# EAGLE design power (EAGLE 7.2.0)
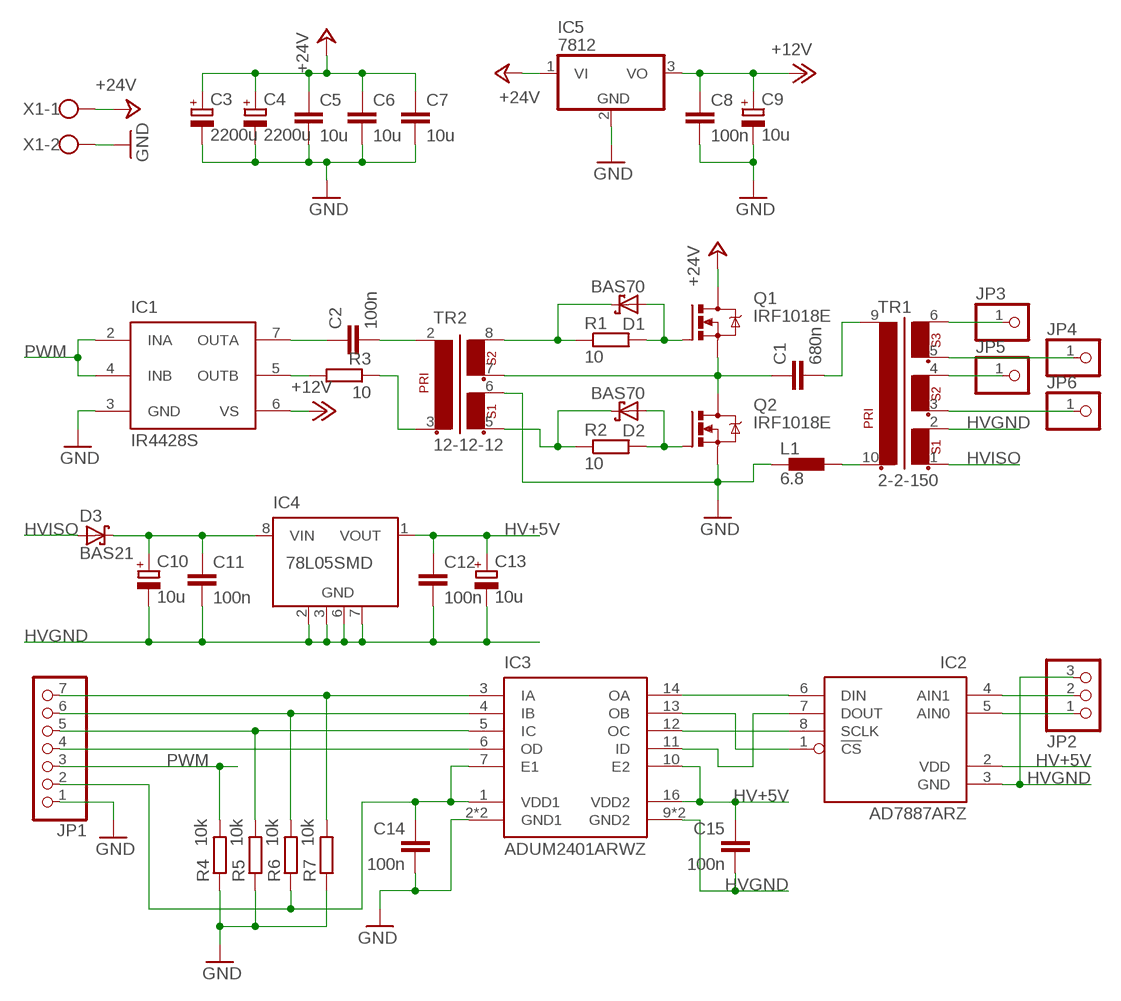
[diagram p0: schematic, sheet 1]

## Parts
C1  680n  C-EU150-084X183  [C150-084X183]
C2  100n  C-EUC1206  [C1206]
C3  2200u  CPOL-EUE7.5-16  [E7,5-16]
C4  2200u  CPOL-EUE7.5-16  [E7,5-16]
C5  10u  C-EUC1210  [C1210]
C6  10u  C-EUC1210  [C1210]
C7  10u  C-EUC1210  [C1210]
C8  100n  C-EUC1206  [C1206]
C9  10u  CPOL-EUB/3528-21R  [B/3528-21R]
C10  10u  CPOL-EUB/3528-21R  [B/3528-21R]
C11  100n  C-EUC1206  [C1206]
C12  100n  C-EUC1206  [C1206]
C13  10u  CPOL-EUB/3528-21R  [B/3528-21R]
C14  100n  C-EUC1206  [C1206]
C15  100n  C-EUC1206  [C1206]
D1  BAS70  [SOT23]
D2  BAS70  [SOT23]
D3  BAS21  BAS70  [SOT23]
IC1  IR4428S  [SO08]
IC2  AD7887ARZ  [SO08]
IC3  ADUM2401ARWZ  [SO-16W]
IC4  78L05SMD  [SO08]
IC5  7812  [D2PACK]
JP1  PINHD-1X7/90  [1X07/90]
JP2  PINHD-1X3/90  [1X03/90]
JP3  PINHD-1X1  [1X01]
JP4  PINHD-1X1  [1X01]
JP5  PINHD-1X1  [1X01]
JP6  PINHD-1X1  [1X01]
L1  6.8  TSL1112  [TSL1112]
Q1  IRF1018E  [TO220BV]
Q2  IRF1018E  [TO220BV]
R1  10  R-EU_R0805  [R0805]
R2  10  R-EU_R0805  [R0805]
R3  10  R-EU_R0805  [R0805]
R4  10k  R-EU_R0805  [R0805]
R5  10k  R-EU_R0805  [R0805]
R6  10k  R-EU_R0805  [R0805]
R7  10k  R-EU_R0805  [R0805]
TR1  2-2-150  [RM12T1]
TR2  12-12-12  [RM5LS]
X1  W237-102  [W237-102]

## Nets
!CS: IC3.3(IA) JP1.7 R7.2
+12V: C8.1 C9.+ IC1.6(VS) IC5.3(VO)
+24V: C3.+ C4.+ C5.1 C6.1 C7.1 IC5.1(VI) Q1.D X1.1
AIN1: IC2.4(AIN1) JP2.2
DIN: IC3.5(IC) JP1.5 R5.2
DOUT: IC3.6(OD) JP1.4
GND: C3.- C4.- C5.2 C6.2 C7.2 C8.2 C9.- C14.2 IC1.3(GND) IC3.2(GND1) IC3.8(GND1) IC5.2(GND) JP1.1 L1.P$1 Q2.S R4.1 R5.1 R7.1 TR2.6 X1.2
HV+5V: C12.1 C13.+ C15.1 IC2.2(VDD) IC3.10(E2) IC3.16(VDD2) IC4.1(VOUT)
HVGND: C10.- C11.2 C12.2 C13.- C15.2 IC2.3(GND) IC3.9(GND2) IC3.15(GND2) IC4.2(GND) IC4.3(GND) IC4.6(GND) IC4.7(GND) JP2.3 TR1.2
HVISO: D3.1(A) TR1.1
N$1: C1.1 Q1.S Q2.D TR2.7
N$2: D1.3(C) R1.1 TR2.8
N$3: D2.1(A) Q2.G R2.2
N$4: C1.2 TR1.9
N$5: D1.1(A) Q1.G R1.2
N$6: D2.3(C) R2.1 TR2.5
N$7: C10.+ C11.1 D3.3(C) IC4.8(VIN)
N$8: C2.1 IC1.7(OUTA)
N$9: R3.1 TR2.3
N$10: C2.2 TR2.2
N$11: C14.1 IC3.1(VDD1) IC3.7(E1) JP1.2 R6.1
N$12: IC2.1(!CS) IC3.13(OB)
N$13: IC2.8(SCLK) IC3.12(OC)
N$14: IC2.7(DOUT) IC3.11(ID)
N$15: IC2.5(AIN0) JP2.1
N$16: IC2.6(DIN) IC3.14(OA)
N$17: L1.P$2 TR1.10
N$18: JP3.1 TR1.6
N$19: JP4.1 TR1.5
N$20: JP5.1 TR1.4
N$21: JP6.1 TR1.3
N$29: IC1.5(OUTB) R3.2
PWM: IC1.2(INA) IC1.4(INB) JP1.3 R4.2
SCLK: IC3.4(IB) JP1.6 R6.2
Unconnected: IC4.4(NC) IC4.5(NC)

## Library data of the parts
C1 C2 C5-C8 C11 C12 C14 C15 = rcl:C-EU: CAPACITOR, European symbol
C3 C4 C9 C10 C13 = rcl:CPOL-EU: POLARIZED CAPACITOR, European symbol
D1-D3 = diode:BAS70: Silicon Schottky Diodes General-purpose diode for high-speed switching
IC1 = local:IR442*: DUAL LOW SIDE DRIVER Descriptions The IR4426/IR4427/IR4428 (S) is a low voltage, high speed power MOSFET and IGBT driver. Proprietary latch immune CMOS technologies enable ruggedized monolithic construction. Logic inputs are compatible with standard CMOS or LSTTL outputs. The output drivers feature a high pulse current buffer stage designed for minimum driver cross-conduction. Propagation delays between two channels are matched.
IC2 = 50w-modular-psu:AD7887: +2.7 V to +5.25 V, Micropower, 2-Channel, 125 kSPS, 12-Bit ADC in 8-Lead µSOIC GENERAL DESCRIPTION The AD7887 is a high speed, low power, 12-bit ADC that oper- ates from a single +2.7 V to +5.25 V power supply. The AD7887 is capable of 125 kSPS throughput rate. The input track-and- hold acquires a signal in 500 ns and features a single-ended sampling scheme. The output coding for the AD7887 is straight binary and the part is capable of converting full power signals up to 2.5 MHz.
IC3 = local:ADUM2401: Quad-Channel Digital Isolators The ADuM240x1 are 4-channel digital isolators based on Analog Devices, Inc., iCoupler® technology. Combining high speed CMOS and monolithic air core transformer technology, these isolation components provide outstanding performance characteristics that are superior to alternatives, such as optocoupler devices.
IC4 = local:78L*SMD: Positive VOLTAGE REGULATOR
IC5 = local:78*: Positive VOLTAGE REGULATOR Source: http://cache.national.com/ds/LM/LM78L05.pdf http://www.fairchildsemi.com/ds/LM/LM7805.pdf
JP1 = pinhead:PINHD-1X7: PIN HEADER
JP2 = pinhead:PINHD-1X3: PIN HEADER
JP3-JP6 = pinhead:PINHD-1X1: PIN HEADER
L1 = local:TSL1112
Q1 Q2 = local:IRF1018: HEXFET Power MOSFET VDSS 60V RDS(on) typ. 7.1m: max. 8.4m: ID 79A
R1-R7 = resistor:R-EU_: RESISTOR, European symbol
TR1 = local:2-2-150: Power Transformer Turns rate: 2/2/150/NC
TR2 = local:12-12-12: Gate Drive Transformer Turns rate: 12/12/12
X1 = con-wago-500:W237-102: WAGO SCREW CLAMP; MPN: 237-102; OC_FARNELL: unknown; OC_NEWARK: 70K9898

## Board
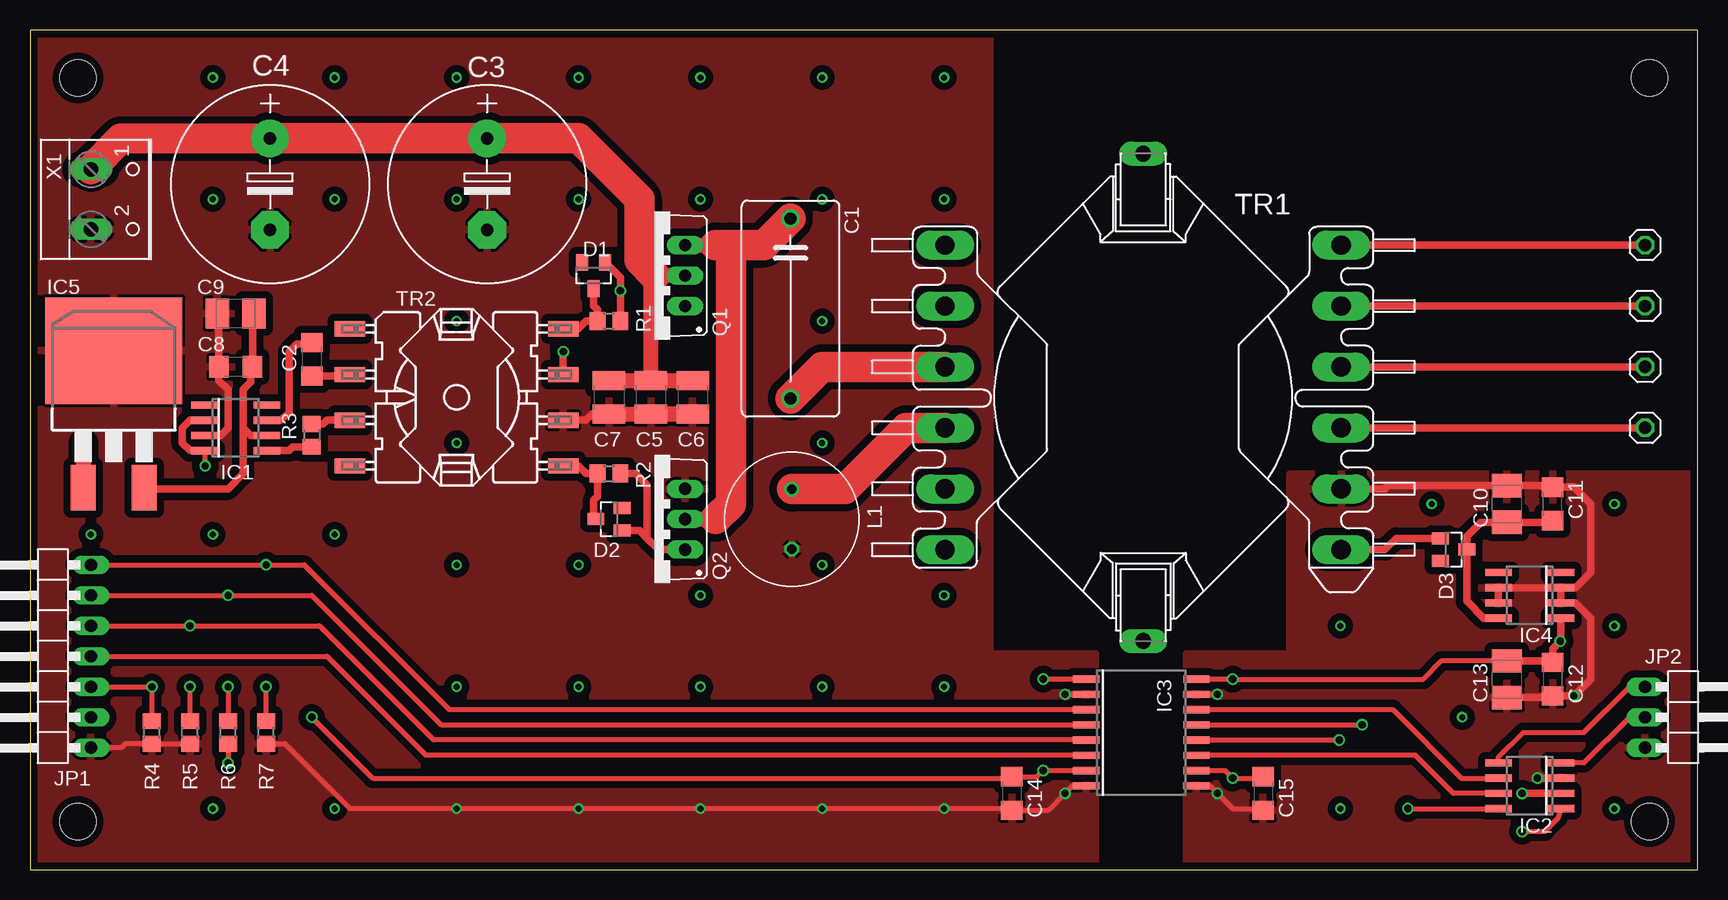
[diagram p1: board, top side]
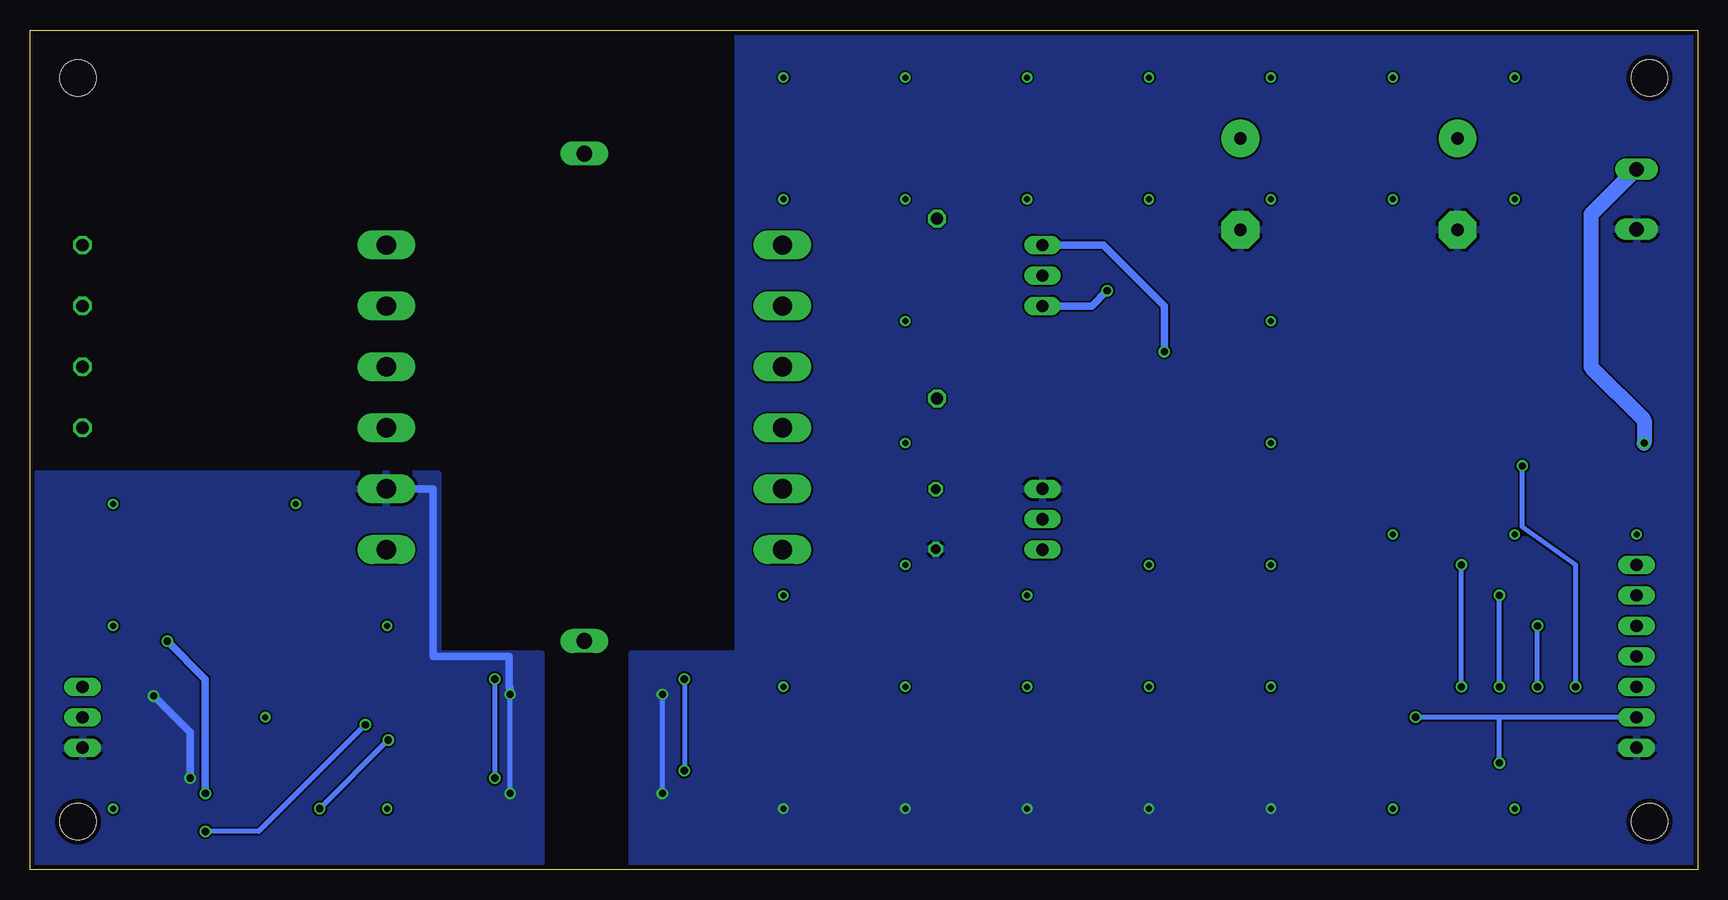
[diagram p2: board, bottom side, seen from below]

Size 139 x 70 mm. Coordinates in mm from the lower left corner, seen from the top.
Outline: 0,0 139,0 139,70 0,70 0,0
Copper layers (1*16): Top 0.0356mm / dielectric 1.5011mm / Bottom 0.0356mm
Design rules "LaenPCBOrder": minimum track width 6mil, minimum drill 13mil, track to track 6mil, track to pad 6mil, pad to pad 6mil, via to via 6mil, smd to smd 6mil, copper to edge 15mil, drill to drill 6mil, minimum pad ring 7mil, minimum via ring 7mil, stop-mask expansion 3mil, vias tented up to drill 0mil, thermal gap 10mil
Holes 3 mm at 4,4 4,66 135,66 135,4

### Footprints (pad centres in the part's own frame; a part is rotated, then mirrored left to right if it is on the bottom)
C150-084X183 = drill 1.016 octagon: 1 -7.493,0; 2 7.493,0
C1206 = smd 1.6 x 1.8: 1 -1.4,0; 2 1.4,0
E7,5-16 = drill 1.016 pad 3.15: + -3.81,0 | drill 1.016 pad 3.15 octagon: - 3.81,0
C1210 = smd 1.6 x 2.7: 1 -1.4,0; 2 1.4,0
B/3528-21R = smd 1.95 x 2.5: + 1.525,0; - -1.525,0
SOT23 = smd 1 x 1.4: 1 -0.95,-1.1; 2 0.95,-1.1; 3 0,1.1
SO08 = smd 0.6 x 2.2: 1 -1.905,-2.6; 2 -0.635,-2.6; 3 0.635,-2.6; 4 1.905,-2.6; 5 1.905,2.6; 6 0.635,2.6; 7 -0.635,2.6; 8 -1.905,2.6
SO-16W = smd 0.6 x 2.2: 1 -4.445,-4.6; 2 -3.175,-4.6; 3 -1.905,-4.6; 4 -0.635,-4.6; 5 0.635,-4.6; 6 1.905,-4.6; 7 3.175,-4.6; 8 4.445,-4.6; 9 4.445,4.6; 10 3.175,4.6; 11 1.905,4.6; 12 0.635,4.6; 13 -0.635,4.6; 14 -1.905,4.6; 15 -3.175,4.6; 16 -4.445,4.6
D2PACK = smd 2.083 x 3.81: 1 -2.54,-8.89; 3 2.54,-8.89 | smd 11.43 x 8.89: 2 0,2.54
1X07/90 = drill 1.016 long: 1 -7.62,-3.81; 2 -5.08,-3.81; 3 -2.54,-3.81; 4 0,-3.81; 5 2.54,-3.81; 6 5.08,-3.81; 7 7.62,-3.81
1X03/90 = drill 1.016 long: 1 -2.54,-3.81; 2 0,-3.81; 3 2.54,-3.81
1X01 = drill 1.016 octagon: 1 0,0
TSL1112 = drill 0.8 octagon: P$1 2.5,0; P$2 -2.5,0
TO220BV = drill 1.016 long: D 0,-2.54; G -2.54,-2.54; S 2.54,-2.54
R0805 = smd 1.3 x 1.5: 1 -0.95,0; 2 0.95,0
RM12T1 = drill 1.6 long: 1 16.51,-12.7; 2 16.51,-7.62; 3 16.51,-2.54; 4 16.51,2.54; 5 16.51,7.62; 6 16.51,12.7; 7 -16.51,12.7; 8 -16.51,7.62; 9 -16.51,2.54; 10 -16.51,-2.54; 11 -16.51,-7.62; 12 -16.51,-12.7 | drill 1.321 long: M 0,20.32; M@ 0,-20.32
RM5LS = smd 2.54 x 1.27: 1 -8.89,5.715; 2 -8.89,1.905; 3 -8.89,-1.905; 4 -8.89,-5.715; 5 8.89,-5.715; 6 8.89,-1.905; 7 8.89,1.905; 8 8.89,5.715
W237-102 = drill 1.194 long: 1 -2.5,-1.27; 2 2.5,-1.27

### Placement (x,y rotation side)
C1  63.39,46.77 270 top
C2  23.5,42.55 270 top
C3  38.1,57.15 270 top
C4  20,57.15 270 top
C5  51.75,39.37 270 top
C6  55.24,39.37 270 top
C7  48.26,39.37 270 top
C8  17.14,41.91 180 top
C9  17.14,46.35 0 top
C10  123.11,30.48 270 top
C11  126.92,30.48 90 top
C12  126.92,15.88 270 top
C13  123.11,15.88 90 top
C14  81.83,6.35 270 top
C15  102.79,6.35 270 top
D1  46.99,49.53 180 top
D2  48.26,29.21 90 top
D3  118.67,26.67 270 top
IC1  17.14,36.83 270 top
IC2  125.02,6.99 90 top
IC3  92.63,11.43 270 top
IC4  125.02,22.86 90 top
IC5  6.99,40.72 0 top
JP1  1.27,17.78 90 top
JP2  138.43,12.7 270 top
JP3  134.62,52.07 0 top
JP4  134.62,46.99 0 top
JP5  134.62,41.91 0 top
JP6  134.62,36.83 0 top
L1  63.5,29.21 270 top
Q1  52.07,49.53 90 top
Q2  52.07,29.21 90 top
R1  48.26,45.72 0 top
R2  48.26,33.02 0 top
R3  23.5,36.2 270 top
R4  10.16,11.43 90 top
R5  13.34,11.43 90 top
R6  16.51,11.43 90 top
R7  19.68,11.43 90 top
TR1  92.79,39.37 0 top
TR2  35.56,39.37 0 top
X1  6.35,55.88 270 top

### Tracks (layer width: path | path; a pad name or v marks a point on that pad's centre or on a via)
!CS  (via drill 0.6)
  Top 0.406: JP1.7 v19.68,25.4 22.86,25.4 34.92,13.34 IC3.3 | R7.2 v19.68,15.24
  Bottom 0.406: v19.68,15.24 v19.68,25.4
+12V
  Top 0.61: IC1.6 18.41,36.2 17.78,36.83 | 17.78,36.83 17.78,40.01 18.41,40.64 18.41,41.78 C8.1 18.55,45.59 C9.+ | 17.78,36.83 17.78,33.02 16.51,31.75 10.24,31.75 IC5.3
+24V  (via drill 0.6)
  Top 1.27: C7.1 C5.1 | C5.1 C6.1 | Q1.D 52.07,49.53 51.75,49.21 C5.1 | v4.45,35.56 IC5.1
  Top 2.54: 52.07,49.53 50.8,50.8 50.8,55.88 45.72,60.96 C3.+ C4.+ 7.58,60.92 X1.1
  Bottom 1.27: X1.1 5.12,58.38 8.89,54.61 8.89,41.91 4.45,37.47 v4.45,35.56
AIN1
  Top 0.406: JP2.2 133.35,12.7 129.54,8.89 IC2.4
DIN  (via drill 0.6)
  Top 0.406: JP1.5 v13.34,20.32 24.13,20.32 33.66,10.79 IC3.5 | R5.2 v13.34,15.24
  Bottom 0.406: v13.34,15.24 v13.34,20.32
DOUT
  Top 0.406: JP1.4 24.77,17.78 33.02,9.53 IC3.6
GND  (via drill 0.5, 0.6)
  Top 0.406: R5.1 R4.1 7.94,10.48 7.62,10.16 JP1.1 | R7.1 21.27,10.48 26.67,5.08 v35.56,5.08 v45.72,5.08 v55.88,5.08 v66.04,5.08 v76.2,5.08 81.07,5.08 C14.2 84.88,4.95 v86.28,6.35 86.92,6.99 IC3.8 | v86.28,14.61 IC3.2
  Top 0.61: C7.2 46.86,37.97 46.35,37.47 TR2.6 | IC1.3 15.88,36.2 16.51,36.83 16.51,40.01 15.74,40.77 C8.2 15.74,45.59 C9.-
  Top 1.27: C7.2 C5.2 C6.2 50.93,37.97 50.8,38.1
  Bottom 0.406: v86.28,6.35 v86.28,14.61
  pour Top (isolate 0.61): 0,0 0,70 80,70 80,18 88.8,18 88.8,0
  pour Bottom: 0,0 0,70 80,70 80,18 88.8,18 88.8,0
HV+5V  (via drill 0.6)
  Top 0.406: IC3.10 99.61,8.26 v100.25,7.62 102.66,7.62 C15.1 | IC3.16 v100.25,15.88 116.12,15.88 117.65,17.4 C13.+
  Top 0.61: C13.+ 126.8,17.4 C12.1 126.92,18.41 v127.56,19.05 127.61,19.11 IC4.1 | IC2.2 v124.38,6.35
  Bottom 0.406: v100.25,7.62 v100.25,15.88
  Bottom 0.61: v124.38,6.35 124.38,15.88 v127.56,19.05
HVGND  (via drill 0.6)
  Top 0.406: IC3.15 v98.98,14.61 | IC3.9 98.34,6.99 v98.98,6.35 100.25,5.08 102.66,5.08 C15.2
  Top 0.61: TR1.2 112.95,31.75 113.2,32.01 C10.- 126.8,32.01 C11.2 128.69,31.88 130.09,30.48 130.09,24.77 128.82,23.5 IC4.3 | IC4.7 IC4.6 IC4.3 | IC4.3 IC4.2 128.82,22.23 130.09,20.95 130.09,15.88 v128.69,14.47 C12.2 126.8,14.35 C13.- | IC2.3 v125.65,7.62
  Bottom 0.406: v98.98,6.35 v98.98,14.61
  Bottom 0.61: v125.65,7.62 125.65,11.43 v128.69,14.47 | v98.98,14.61 98.98,15.16 99.06,15.24 99.06,17.78 105.41,17.78 105.41,31.75 109.22,31.75
  pour Top (isolate 0.61): 96.4,18 96.4,0 139,0 139,33 105,33 105,18
  pour Bottom: 139,33 105,33 105,18 96.4,18 96.4,0 139,0
HVISO
  Top 0.61: D3.1 113.9,27.62 112.95,26.67 TR1.1
N$1  (via drill 0.6)
  Top 0.61: v44.45,43.18 TR2.7
  Top 1.27: Q1.S 57.15,52.07 | Q2.D 57.15,29.21
  Top 2.54: 57.15,52.07 58.42,52.07 | 58.42,52.07 61.2,52.07 C1.1 | 57.15,29.21 58.42,30.48 58.42,52.07
  Bottom 0.61: Q1.S 49.53,52.07 44.45,46.99 v44.45,43.18
N$2
  Top 0.61: TR2.8 45.72,45.09 46.35,45.72 R1.1 47.31,46.67 46.99,46.99 D1.3
N$3
  Top 0.61: R2.2 50.48,33.02 51.44,32.07 51.44,27.62 | 51.44,27.62 52.39,26.67 Q2.G | D2.1 50.8,28.26 51.44,27.62
N$4
  Top 2.54: TR1.9 66.02,41.91 C1.2
N$5  (via drill 0.6)
  Top 0.61: R1.2 v49.21,48.26 49.21,49.36 D1.1
  Bottom 0.61: Q1.G 50.48,46.99 v49.21,48.26
N$6
  Top 0.61: TR2.5 45.72,33.66 46.35,33.02 R2.1 47.31,31.12 46.99,30.8 46.99,29.38 D2.3
N$7
  Top 0.61: IC4.8 121.2,20.95 119.77,22.39 D3.3 119.77,27.77 120.95,28.95 C10.+ 126.8,28.95 C11.1
N$8
  Top 0.61: IC1.7 20.95,37.47 21.59,38.1 21.59,43.18 22.23,43.81 23.36,43.81 C2.1
N$9
  Top 0.61: R3.1 24.45,37.15 24.77,37.47 TR2.3
N$10
  Top 0.61: C2.2 26.54,41.15 TR2.2
N$11  (via drill 0.6)
  Top 0.406: v23.5,12.7 28.57,7.62 81.07,7.62 C14.1 83.95,7.75 v84.45,8.26 IC3.7 | IC3.1 v84.45,15.88 | R6.1 v16.51,8.89
  Bottom 0.406: JP1.2 16.51,12.7 | 16.51,12.7 v23.5,12.7 | v84.45,15.88 v84.45,8.26 | v16.51,8.89 16.51,12.7
N$12  (via drill 0.6)
  Top 0.406: IC3.13 v111.05,12.06 | IC2.1 127.36,4.25 126.28,3.17 v124.38,3.17
  Bottom 0.406: v111.05,12.06 119.94,3.17 v124.38,3.17
N$13  (via drill 0.6)
  Top 0.406: IC3.12 v109.14,10.79 | v114.86,5.08 IC2.8
  Bottom 0.406: v109.14,10.79 v114.86,5.08
N$14
  Top 0.406: IC2.7 118.67,6.35 115.49,9.53 IC3.11
N$15
  Top 0.406: JP2.1 133.35,15.24 129.54,11.43 124.46,11.43 122.42,9.38 IC2.5
N$16
  Top 0.406: IC3.14 113.58,13.34 119.3,7.62 IC2.6
N$17
  Top 2.54: TR1.10 73.03,36.83 67.94,31.75 63.54,31.75 L1.P$2
N$18
  Top 0.61: TR1.6 JP3.1
N$19
  Top 0.61: TR1.5 JP4.1
N$20
  Top 0.61: TR1.4 JP5.1
N$21
  Top 0.61: TR1.3 JP6.1
N$22  (via drill 0.5)
  other vias: 35.56,66.04
N$23  (via drill 0.5)
  other vias: 25.4,66.04
N$24  (via drill 0.5)
  other vias: 15.24,66.04
N$25  (via drill 0.5)
  other vias: 55.88,55.88
N$26  (via drill 0.5)
  other vias: 66.04,55.88
N$27  (via drill 0.5)
  other vias: 45.72,66.04
N$28  (via drill 0.5)
  other vias: 55.88,66.04
N$29
  Top 0.61: R3.2 21.91,35.24 21.59,34.92 IC1.5
N$30  (via drill 0.5)
  other vias: 66.04,66.04
N$31  (via drill 0.5)
  other vias: 76.2,66.04
N$32  (via drill 0.5)
  other vias: 76.2,55.88
N$33  (via drill 0.5)
  other vias: 45.72,55.88
N$34  (via drill 0.5)
  other vias: 35.56,55.88
N$35  (via drill 0.5)
  other vias: 66.04,45.72
N$36  (via drill 0.5)
  other vias: 66.04,35.56
N$37  (via drill 0.5)
  other vias: 45.72,25.4
N$38  (via drill 0.5)
  other vias: 55.88,22.86
N$39  (via drill 0.5)
  other vias: 66.04,25.4
N$40  (via drill 0.5)
  other vias: 25.4,55.88
N$41  (via drill 0.5)
  other vias: 15.24,55.88
N$42  (via drill 0.5)
  other vias: 35.56,45.72
N$43  (via drill 0.5)
  other vias: 35.56,35.56
N$44  (via drill 0.5)
  other vias: 35.56,25.4
N$45  (via drill 0.5)
  other vias: 35.56,15.24
N$46  (via drill 0.5)
  other vias: 45.72,15.24
N$47  (via drill 0.5)
  other vias: 55.88,15.24
N$48  (via drill 0.5)
  other vias: 66.04,15.24
N$49  (via drill 0.5)
  other vias: 25.4,27.94
N$50  (via drill 0.5)
  other vias: 15.24,27.94
N$51  (via drill 0.5)
  other vias: 5.08,27.94
N$53  (via drill 0.5)
  other vias: 109.22,20.32
N$54  (via drill 0.5)
  other vias: 109.22,5.08
N$55  (via drill 0.5)
  other vias: 132.08,5.08
N$56  (via drill 0.5)
  other vias: 132.08,20.32
N$57  (via drill 0.5)
  other vias: 116.84,30.48
N$58  (via drill 0.5)
  other vias: 132.08,30.48
N$59  (via drill 0.5)
  other vias: 119.38,12.7
N$60  (via drill 0.5)
  other vias: 15.24,5.08
N$61  (via drill 0.5)
  other vias: 25.4,5.08
N$62  (via drill 0.5)
  other vias: 76.2,15.24
N$63  (via drill 0.5)
  other vias: 76.2,22.86
PWM  (via drill 0.6)
  Top 0.406: JP1.3 v10.16,15.24 R4.2 | v14.61,33.66 14.61,34.73 IC1.4
  Top 0.61: IC1.4 13.34,34.92 12.7,35.56 12.7,36.83 13.34,37.47 IC1.2
  Bottom 0.406: v10.16,15.24 10.16,25.4 14.61,28.57 v14.61,33.66
SCLK  (via drill 0.6)
  Top 0.406: JP1.6 v16.51,22.86 23.5,22.86 34.29,12.06 IC3.4 | v16.51,15.24 R6.2
  Bottom 0.406: v16.51,15.24 v16.51,22.86